# EAGLE design ledboard (EAGLE 6.4)
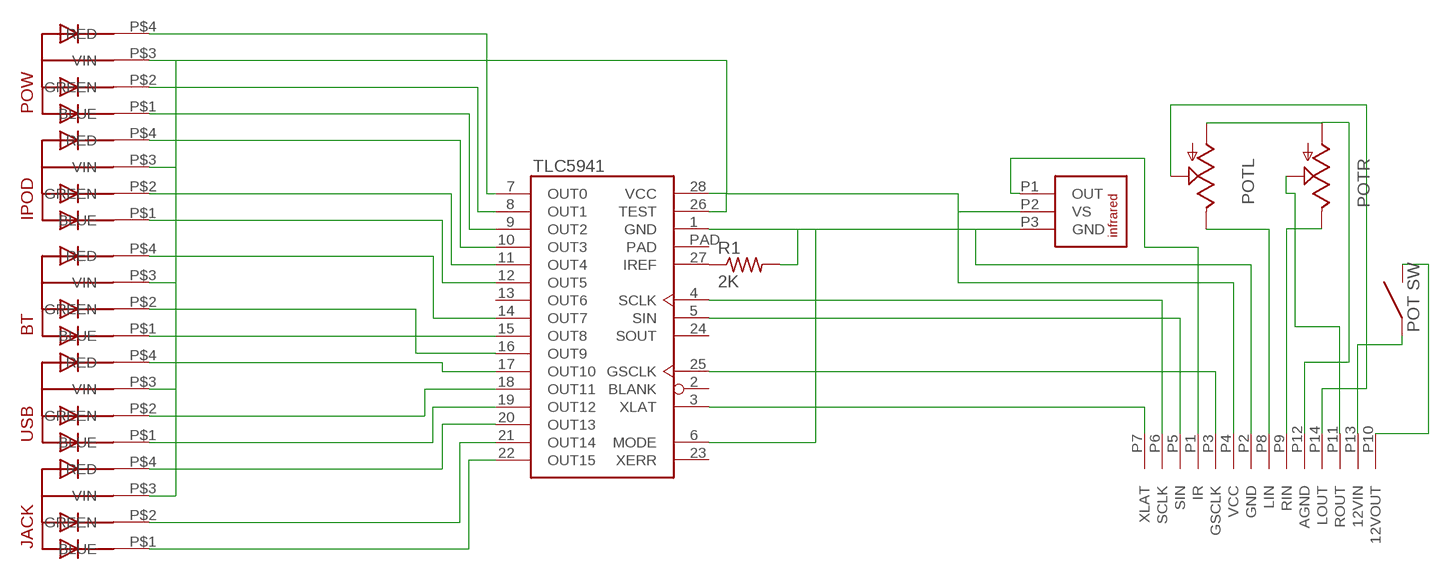
[diagram p0: schematic, sheet 1]

## Parts
BT  5MMRGBLEDBENT  [BENTLED]
IPOD  5MMRGBLEDBENT  [BENTLED]
IR  TSOP323  [TSOP323]
JACK  5MMRGBLEDBENT  [BENTLED]
POT  ALPS_RK0971221Z0N  [ALPS_RK0971221Z0X]
POW  5MMRGBLEDBENT  [BENTLED]
R1  2K  R-US_0207/7  [0207/7]
U$1  TLC5941  [HTSSOP28_POWERPAD]
U$3  CONNECTOR  [CON]
USB  5MMRGBLEDBENT  [BENTLED]

## Nets
N$1: BT.P$3(VIN) IPOD.P$3(VIN) IR.P2(VS) JACK.P$3(VIN) POW.P$3(VIN) U$1.26(TEST) U$1.28(VCC) U$3.P4(VCC) USB.P$3(VIN)
N$2: POW.P$4(RED) U$1.7(OUT0)
N$3: POW.P$2(GREEN) U$1.8(OUT1)
N$4: POW.P$1(BLUE) U$1.9(OUT2)
N$5: IPOD.P$4(RED) U$1.10(OUT3)
N$6: IPOD.P$2(GREEN) U$1.11(OUT4)
N$7: IPOD.P$1(BLUE) U$1.12(OUT5)
N$8: BT.P$4(RED) U$1.14(OUT7)
N$9: BT.P$1(BLUE) U$1.15(OUT8)
N$10: U$1.19(OUT12) USB.P$1(BLUE)
N$11: JACK.P$1(BLUE) U$1.22(OUT15)
N$12: BT.P$2(GREEN) U$1.16(OUT9)
N$13: U$1.17(OUT10) USB.P$4(RED)
N$14: U$1.4(SCLK) U$3.P6(SCLK)
N$15: JACK.P$4(RED) U$1.20(OUT13)
N$16: POT.G1 POT.G2 U$3.P12(AGND)
N$17: U$1.18(OUT11) USB.P$2(GREEN)
N$18: JACK.P$2(GREEN) U$1.21(OUT14)
N$19: R1.1 U$1.27(IREF)
N$20: IR.P3(GND) R1.2 U$1.1(GND) U$1.6(MODE) U$3.P2(GND)
N$21: U$1.5(SIN) U$3.P5(SIN)
N$22: IR.P1(OUT) U$3.P1(IR)
N$23: POT.I1 U$3.P8(LIN)
N$24: U$1.25(GSCLK) U$3.P3(GSCLK)
N$25: U$1.3(XLAT) U$3.P7(XLAT)
N$26: POT.I2 U$3.P9(RIN)
N$27: POT.O1 U$3.P14(LOUT)
N$28: POT.O2 U$3.P11(ROUT)
N$29: POT.S1 U$3.P13(12VIN)
N$30: POT.S2 U$3.P10(12VOUT)
Unconnected: U$1.2(BLANK) U$1.13(OUT6) U$1.23(XERR) U$1.24(SOUT) U$1.PAD

## Library data of the parts
BT IPOD JACK POW USB = led_rgb:5MMRGBLED
IR = tsop321:TSOP323
POT = audio-pots:ALPS_RK0971221Z0*: ALPS RK0971221Z Dual-gang 9mm potentiometer for volume control, with SPST switch -05 model: 10K with "volume" taper -0N model: 50K with traditional audio taper
R1 = resistor:R-US_: RESISTOR, American symbol
U$1 = tlc594X:TLC5941
U$3 = connector:CONNECTOR

## Board
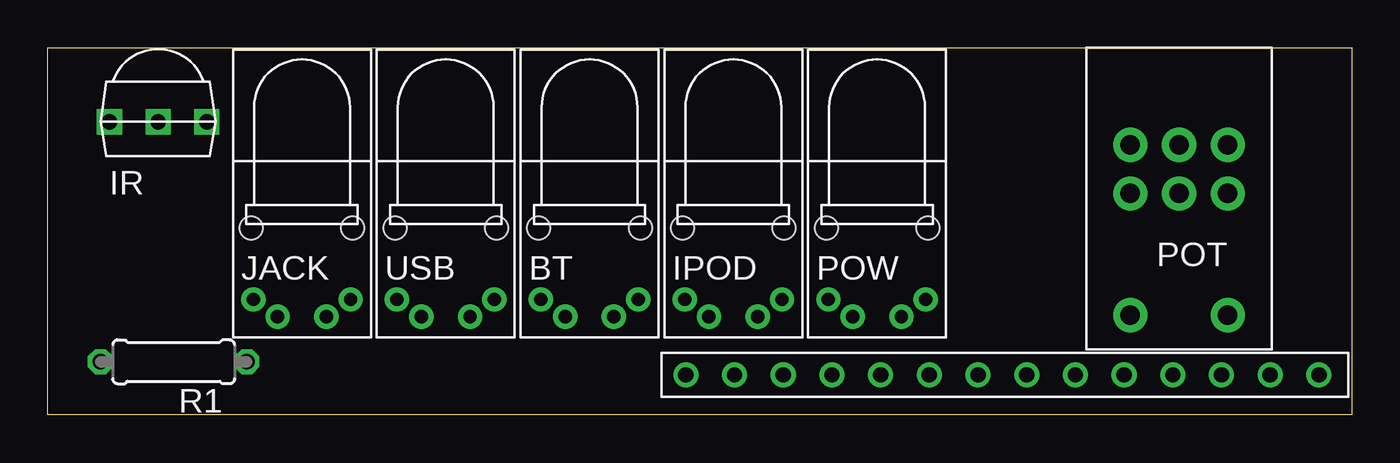
[diagram p1: board, top side]
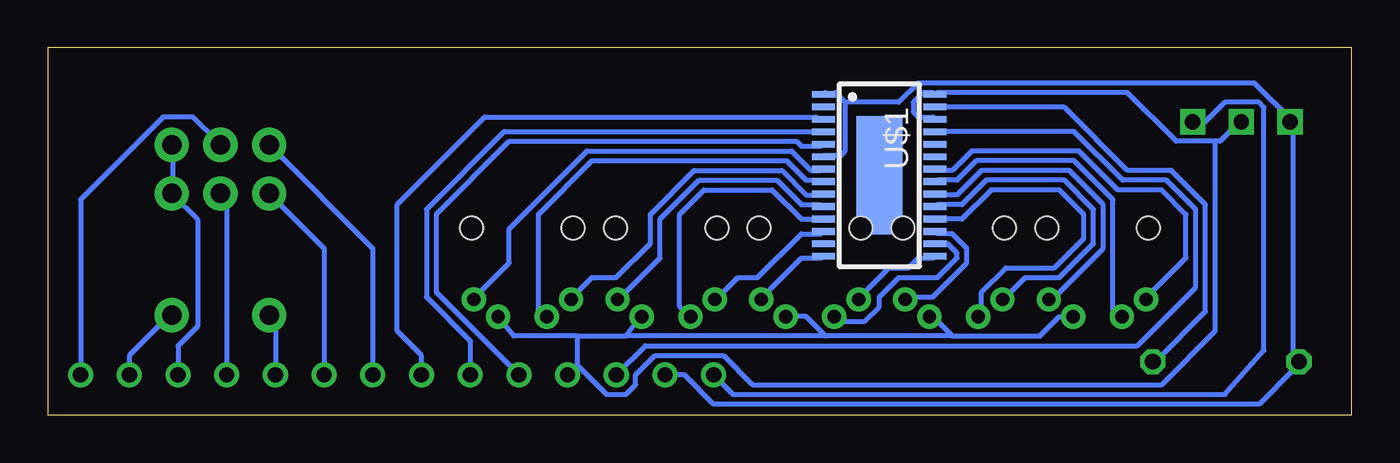
[diagram p2: board, bottom side, seen from below]

Size 68 x 19.16 mm. Coordinates in mm from the lower left corner, seen from the top.
Outline: 0,0 0,19.16 68,19.16 68,0 0,0
Copper layers (1*16): Top 0.035mm / dielectric 1.5mm / Bottom 0.035mm
Design rules "default *": minimum track width 10mil, minimum drill 24mil, track to track 8mil, track to pad 8mil, pad to pad 8mil, via to via 8mil, smd to smd 8mil, copper to edge 40mil, drill to drill 8mil, minimum pad ring 10mil, minimum via ring 8mil, stop-mask expansion 4mil, vias tented up to drill 0mil, thermal gap 10mil

### Footprints (pad centres in the part's own frame; a part is rotated, then mirrored left to right if it is on the bottom)
BENTLED = drill 0.7 pad 1.27: P$1 -2.54,-0.381; P$2 -1.27,-1.27; P$3 1.27,-1.27; P$4 2.54,-0.381 | hole 1.2: -2.65,3.35; 2.65,3.35
TSOP323 = drill 0.8 square: P1 2.54,0; P2 0,0; P3 -2.54,0
ALPS_RK0971221Z0X = drill 1.016 pad 1.778: G1 2.54,-2.54; G2 0,-2.54; I1 2.54,2.54; I2 0,2.54; O1 2.54,0; O2 0,0; S1 -6.35,-2.54; S2 -6.35,2.54
0207/7 = drill 0.813 octagon: 1 -3.81,0; 2 3.81,0
HTSSOP28_POWERPAD = smd 0.35 x 1.2: 1 -4.225,-2.9; 2 -3.575,-2.9; 3 -2.925,-2.9; 4 -2.275,-2.9; 5 -1.625,-2.9; 6 -0.975,-2.9; 7 -0.325,-2.9; 8 0.325,-2.9; 9 0.975,-2.9; 10 1.625,-2.9; 11 2.275,-2.9; 12 2.925,-2.9; 13 3.575,-2.9; 14 4.225,-2.9; 15 4.225,2.9; 16 3.575,2.9; 17 2.925,2.9; 18 2.275,2.9; 19 1.625,2.9; 20 0.975,2.9; 21 0.325,2.9; 22 -0.325,2.9; 23 -0.975,2.9; 24 -1.625,2.9; 25 -2.275,2.9; 26 -2.925,2.9; 27 -3.575,2.9; 28 -4.225,2.9 | smd 6.17 x 2.4: PAD 0,0
CON = drill 0.8: P1 -12.7,0; P2 -10.16,0; P3 -7.62,0; P4 -5.08,0; P5 -2.54,0; P6 0,0; P7 2.54,0; P8 5.08,0; P9 7.62,0; P10 10.16,0; P11 12.7,0; P12 15.24,0; P13 17.78,0; P14 20.32,0

### Placement (x,y rotation side)
BT  28.25,6.41 0 top
IPOD  35.75,6.41 0 top
IR  5.75,15.3 0 top
JACK  13.25,6.41 0 top
POT  59,11.56 90 top
POW  43.25,6.41 0 top
R1  6.56,2.77 180 top
U$1  24.64,12.5 270 bottom
U$3  45.97,2.09 0 top
USB  20.75,6.41 0 top

### Tracks (layer width: path | path; a pad name or v marks a point on that pad's centre or on a via)
N$1
  Bottom 0.254: 7.11,14.28 6.86,14.28 5.84,15.3 IR.P2 | 7.11,14.28 9.14,14.28 11.68,16.82 21.59,16.82 U$1.28 21.84,16.82 22.35,16.82 22.86,16.31 22.86,15.81 22.61,15.55 21.84,15.55 U$1.26 | 37.85,4.12 37.08,5.14 IPOD.P$3 | U$3.P4 40.39,2.6 | 40.39,2.6 40.39,4.12 | 40.39,4.12 37.85,4.12 | 40.39,4.12 43.69,4.12 POW.P$3 | JACK.P$3 15.24,5.14 16.26,4.12 20.83,4.12 | 20.83,4.12 21.84,5.14 USB.P$3 | BT.P$3 28.45,5.14 27.43,4.12 | 20.83,4.12 27.43,4.12 | 27.43,4.12 37.85,4.12 | 7.11,14.28 7.11,4.38 9.91,1.58 31.24,1.58 32.77,3.11 36.32,3.11 37.34,2.09 37.34,1.58 37.85,1.07 38.86,1.07 40.39,2.6
N$2
  Bottom 0.254: U$1.7 27.69,12.76 28.19,12.76 29.21,13.77 39.88,13.77 43.94,9.71 43.94,7.93 45.72,6.15 POW.P$4
N$3
  Bottom 0.254: U$1.8 27.69,12.25 28.45,12.25 29.46,13.27 39.62,13.27 42.42,10.47 42.42,5.39 42.16,5.14 POW.P$2
N$4
  Bottom 0.254: U$1.9 27.69,11.49 28.45,11.49 29.72,12.76 34.29,12.76 36.58,10.47 36.58,8.95 38.35,7.17 39.62,7.17 40.64,6.15 POW.P$1
N$5
  Bottom 0.254: U$1.10 27.69,10.98 28.7,10.98 29.97,12.25 34.04,12.25 36.07,10.22 36.07,8.19 38.1,6.15 IPOD.P$4
N$6
  Bottom 0.254: U$1.11 27.69,10.22 28.7,10.22 30.23,11.74 33.78,11.74 35.05,10.47 35.05,5.65 34.54,5.14 IPOD.P$2
N$7
  Bottom 0.254: U$1.12 27.69,9.46 28.7,9.46 30.99,7.17 32,7.17 33.02,6.15 IPOD.P$1
N$8
  Bottom 0.254: U$1.14 27.69,8.19 28.7,8.19 30.73,6.15 BT.P$4
N$9
  Bottom 0.254: U$1.15 21.84,8.19 22.61,8.19 23.11,7.68 24.13,7.68 25.65,6.15 BT.P$1
N$10
  Bottom 0.254: U$1.19 21.59,10.98 20.32,10.98 19.05,12.25 14.99,12.25 13.46,10.73 13.46,8.95 15.24,7.17 17.02,7.17 18.03,6.15 USB.P$1
N$11
  Bottom 0.254: U$1.22 21.59,12.76 20.83,12.76 19.81,13.77 14.22,13.77 12.19,11.74 9.91,11.74 8.64,10.47 8.64,8.19 10.67,6.15 JACK.P$1
N$12
  Bottom 0.254: U$1.16 21.59,8.95 21.08,8.95 20.57,8.44 20.57,8.19 21.59,7.17 23.62,7.17 24.64,6.15 24.64,5.65 25.4,4.88 26.67,4.88 26.92,5.14 BT.P$2
N$13
  Bottom 0.254: U$1.17 21.59,9.46 20.83,9.46 20.07,8.69 20.07,7.93 21.84,6.15 23.11,6.15 USB.P$4
N$14
  Bottom 0.254: U$1.4 27.69,14.79 44.2,14.79 48.26,10.73 48.26,6.15 45.97,3.87 U$3.P6
N$15
  Bottom 0.254: U$1.20 21.59,11.49 20.57,11.49 19.3,12.76 14.73,12.76 12.95,10.98 12.95,8.69 15.75,5.9 JACK.P$4
N$16
  Bottom 0.254: U$3.P12 61.21,3.61 60.2,4.63 60.2,10.22 61.47,11.49 POT.G2 61.47,11.74 61.47,14.03 POT.G1
N$17
  Bottom 0.254: U$1.18 21.59,10.22 20.32,10.22 18.8,11.74 15.24,11.74 13.97,10.47 13.97,9.2 15.49,7.68 18.03,7.68 19.3,6.41 19.3,5.14 USB.P$2
N$18
  Bottom 0.254: U$1.21 21.59,12.25 20.57,12.25 19.56,13.27 14.48,13.27 12.45,11.23 12.45,5.39 12.19,5.14 JACK.P$2
N$19
  Bottom 0.254: U$1.27 21.59,16.06 14.99,16.06 11.68,12.76 9.4,12.76 7.62,10.98 7.62,5.39 10.16,2.85 R1.1
N$20
  Bottom 0.254: 3.05,15.3 5.08,17.33 22.61,17.33 23.62,16.31 26.42,16.31 | 27.43,16.82 U$1.1 | U$3.P2 34.8,2.09 33.27,0.57 4.83,0.57 3.05,2.34 | 3.05,2.34 2.79,2.6 R1.2 3.05,2.34 | 3.05,2.34 3.05,15.3 | 3.05,15.3 IR.P3 | 26.92,13.52 26.67,13.52 26.42,13.77 26.42,16.31 | 26.42,16.31 26.92,16.82 26.92,16.73
  Bottom 0.305: U$1.1 26.92,16.73 26.83,16.73 | 26.92,13.52 27.5,13.52 U$1.6
N$21
  Bottom 0.254: U$1.5 27.69,14.03 28.7,14.03 28.96,14.28 43.94,14.28 47.75,10.47 47.75,6.41 U$3.P5
N$22
  Bottom 0.254: IR.P1 7.62,15.3 6.6,16.31 4.83,16.31 4.57,16.06 4.57,3.36 6.6,1.07 32.26,1.07 U$3.P1
N$23
  Bottom 0.254: U$3.P8 51.05,8.69 56.39,14.03 POT.I1
N$24
  Bottom 0.254: U$3.P3 36.83,3.61 11.18,3.61 8.13,6.66 8.13,10.73 9.65,12.25 11.94,12.25 14.48,14.79 21.59,14.79 U$1.25
N$25
  Bottom 0.254: U$3.P7 48.51,3.11 49.78,4.38 49.78,10.98 45.21,15.55 27.94,15.55 U$1.3
N$26
  Bottom 0.254: U$3.P9 53.59,8.69 56.39,11.49 POT.I2
N$27
  Bottom 0.254: U$3.P14 66.29,11.23 61.98,15.55 60.45,15.55 59.18,14.28 POT.O1
N$28
  Bottom 0.254: U$3.P11 58.67,11.23 58.93,11.49 POT.O2
N$29
  Bottom 0.254: U$3.P13 63.75,3.11 61.72,5.14 POT.S1
N$30
  Bottom 0.254: U$3.P10 56.13,4.88 56.39,5.14 POT.S2